# Altium schematic sheet Sheet1.SchDoc: Projet M1 équipe 2
size A4; Date: 18/11/2024; DrawnBy: T.LOPEZ / Jordan Chevalier; DocumentNumber: 1; Revision: V1.0 Rev A; SheetNumber: 1; SheetTotal: 3; Sheet Utility: Circuit hardware alimentation
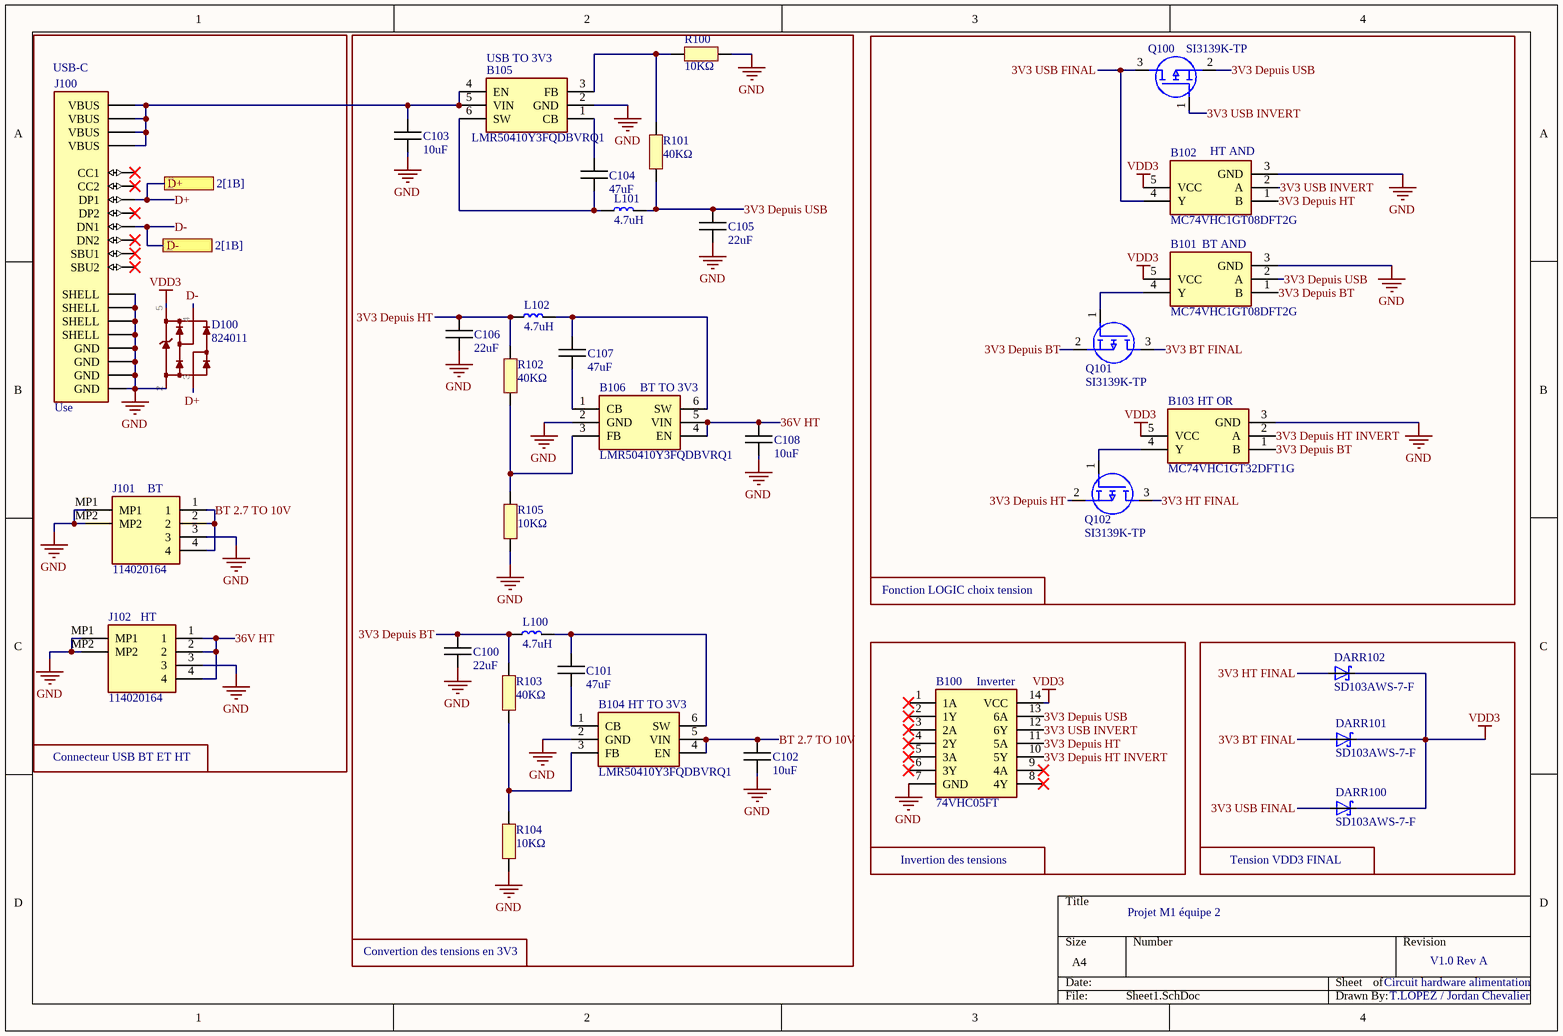
[diagram p0: Sheet1.SchDoc]

## Parts
B100  74VHC05FT  [SOP65P640X120-14N]
B101  MC74VHC1GT08DFT2G  [SOT65P210X110-5N]
B102  MC74VHC1GT08DFT2G  [SOT65P210X110-5N]
B103  MC74VHC1GT32DFT1G  [SOT65P210X110-5N]
B104  LMR50410Y3FQDBVRQ1  [SOT95P280X145-6N]
B105  LMR50410Y3FQDBVRQ1  [SOT95P280X145-6N]
B106  LMR50410Y3FQDBVRQ1  [SOT95P280X145-6N]
C100  22uF  [CAPC1005X06N]
C101  47uF  [CAPC1005X06N]
C102  10uF  [CAPC1005X06N]
C103  10uF  [CAPC1005X06N]
C104  47uF  [CAPC1005X06N]
C105  22uF  [CAPC1005X06N]
C106  22uF  [CAPC1005X06N]
C107  47uF  [CAPC1005X06N]
C108  10uF  [CAPC1005X06N]
D100  824011  [824011]
DARR100  SD103AWS-7-F  [SD103AWS-7-F]
DARR101  SD103AWS-7-F  [SD103AWS-7-F]
DARR102  SD103AWS-7-F  [SD103AWS-7-F]
J100  Use  [USB4085-GF-A]
J101  114020164  [114020164]
J102  114020164  [114020164]
L100  4.7uH  [LQPC1005X06N]
L101  4.7uH  [LQPC1005X06N]
L102  4.7uH  [LQPC1005X06N]
Q100  SI3139K-TP  [SI3139K-TP]
Q101  SI3139K-TP  [SI3139K-TP]
Q102  SI3139K-TP  [SI3139K-TP]
R100  10KΩ  [RESC1005X06N]
R101  40KΩ  [RESC1005X06N]
R102  40KΩ  [RESC1005X06N]
R103  40KΩ  [RESC1005X06N]
R104  10KΩ  [RESC1005X06N]
R105  10KΩ  [RESC1005X06N]

## Blocks framed on the sheet
Tension VDD3 FINAL: DARR100-DARR102

## Ports
D+ (see 2[1B]), D- (see 2[1B])

## Nets
GND: B100.7(GND) B101.3(GND) B102.3(GND) B103.3(GND) B104.2(GND) B105.2(GND) B106.2(GND) C100.2 C102.2 C103.2 C105.2 C106.2 C108.2 D100.2(GND) J100.A1(GND) J100.A12(GND) J100.B1(GND) J100.B12(GND) J100.S1(SHELL) J100.S2(SHELL) J100.S3(SHELL) J100.S4(SHELL) J101.3 J101.MP1 J101.MP2 J102.3 J102.MP1 J102.MP2 R100.1 R104.1 R105.1
VDD3: B100.14(VCC) B101.5(VCC) B102.5(VCC) B103.5(VCC) D100.5(VDD) DARR100.1(C) DARR101.1(C) DARR102.1(C)
3V3 BT FINAL: DARR101.2(A) Q101.3(D)
3V3 Depuis BT: B101.1(B) B103.1(B) C100.1 L100.1 Q101.2(S) R103.2
3V3 Depuis HT: B100.11(5A) B102.1(B) C106.1 L102.1 Q102.2(S) R102.2
3V3 Depuis HT INVERT: B100.10(5Y) B103.2(A)
3V3 Depuis USB: B100.13(6A) B101.2(A) C105.1 L101.2 Q100.2(S) R101.2
3V3 HT FINAL: DARR102.2(A) Q102.3(D)
3V3 USB FINAL: B102.4(Y) DARR100.2(A) Q100.3(D)
3V3 USB INVERT: B100.12(6Y) B102.2(A) Q100.1(G)
36V HT: B106.4(EN) B106.5(VIN) C108.1 J102.1 J102.2 J102.4
BT 2.7 TO 10V: B104.4(EN) B104.5(VIN) C102.1 J101.1 J101.2 J101.4
D+: D100.3 J100.A6(DP1) ; port D+
D-: D100.4 J100.A7(DN1) ; port D-
NetB101_4: B101.4(Y) Q101.1(G)
NetB103_4: B103.4(Y) Q102.1(G)
NetB104_1: B104.1(CB) C101.2
NetB104_3: B104.3(FB) R103.1 R104.2
NetB104_6: B104.6(SW) C101.1 L100.2
NetB105_1: B105.1(CB) C104.2
NetB105_3: B105.3(FB) R100.2 R101.1
NetB105_4: B105.4(EN) B105.5(VIN) C103.1 J100.A4(VBUS) J100.A9(VBUS) J100.B4(VBUS) J100.B9(VBUS)
NetB105_6: B105.6(SW) C104.1 L101.1
NetB106_1: B106.1(CB) C107.2
NetB106_3: B106.3(FB) R102.1 R105.2
NetB106_6: B106.6(SW) C107.1 L102.2

Not connected (* = marked no-connect by the designer): B100 1(1A)* 2(1Y)* 3(2A)* 4(2Y)* 5(3A)* 6(3Y)* 8(4Y)* 9(4A)*; J100 A5(CC1)* A8(SBU1)* B5(CC2)* B6(DP2)* B7(DN2)* B8(SBU2)*

## Notes on the sheet
- (near J100) USB-C
- (near B105) USB TO 3V3
- (near B102) HT AND
- (near B101) BT AND
- (near B106) BT TO 3V3
- (near B103) HT OR
- (near J101) BT
- (near J102) HT
- Fonction LOGIC choix tension
- (near B104) HT TO 3V3
- (near B100) Inverter
- Connecteur USB BT ET HT
- Invertion des tensions
- Convertion des tensions en 3V3

## Library data of the parts
B100 = 74VHC05FT: Logic Gates CMOS LOGIC IC INVERTER; Manufacturer_Name: Toshiba; Manufacturer_Part_Number: 74VHC05FT; Mouser Part Number: 757-74VHC05FT
B101 B102 = MC74VHC1GT08DFT2G: Single 2-Input AND Gate, TTL Level; Manufacturer_Name: onsemi; Manufacturer_Part_Number: MC74VHC1GT08DFT2G; Parameter 3: *
B103 = MC74VHC1GT32DFT1G: Single 2-Input OR Gate, TTL Level; Manufacturer_Name: onsemi; Manufacturer_Part_Number: MC74VHC1GT32DFT1G; Mouser Part Number: 863-C74VHC1GT32DFT1G
B104-B106 = LMR50410Y3FQDBVRQ1: Régulateurs de tension de commutation Automotive qualified SIMPLE SWITCHER 4-V to 36-V, 1-A synchronous step-down converter 6-SOT-23 -40 to 150; Manufacturer_Name: Texas Instruments; Manufacturer_Part_Number: LMR50410Y3FQDBVRQ1; Mouser Part Number: 595-R50410Y3FQDBVRQ1
C100-C108 = Capacitor
D100 = 824011: TVS Diode Array WE-TVS, High Speed Series  - Low capazity - No leakage current - Low clamping voltage - high ESD voltage protection  -- USB 1.0 - 2.0
DARR100-DARR102 = SD103AWS-7-F: Diode Array 3 Independent Schottky 40V 175mA Surface Mount 6-TSSOP, SC-88, SOT-363
J100 = USB4085-GF-A: Connecteurs USB USB Type C, 2.0, Rec, TH , G/F, RA , Top Mnt, T & R
J101 J102 = 114020164: Seeed Studio Accessories Grove Female Header - SMD-4P-2.0mm-90D-20Pcs; Manufacturer_Name: Seeed Studio; Manufacturer_Part_Number: 114020164; Mouser Part Number: 713-114020164
L100-L102 = Bobine
Q100-Q102 = SI3139K-TP: MOSFET P-Channel MOSFET
R100-R105 = Resistor